# Altium schematic sheet Module_Esp32.SchDoc
size A4
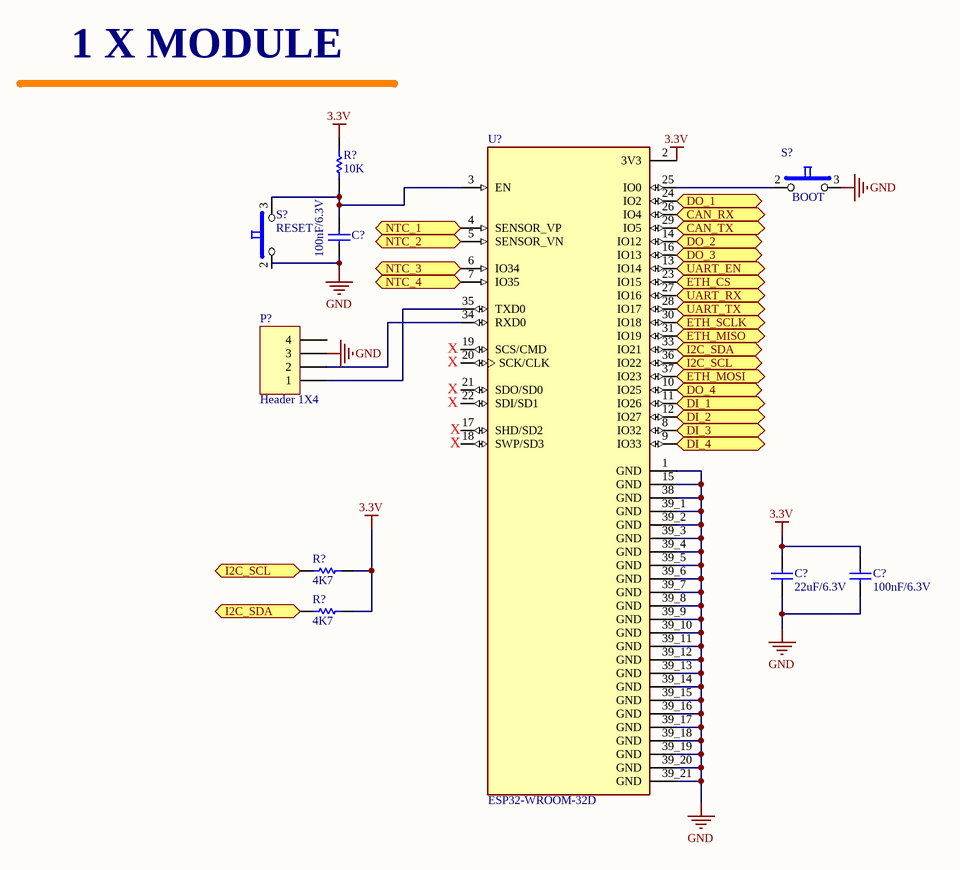
[diagram p0: Module_Esp32.SchDoc]

## Parts
(Parts that share a designator on the sheet are numbered #1, #2 ... from top to bottom, then left to right.)
C?#1  100nF/6.3V  [CAP0603W]
C?#2  22uF/6.3V  [CAP0603W]
C?#3  100nF/6.3V  [CAP0603W]
P?  Header 1X4  [HDR1X4]
R?#1  10K  [RES1608[0603]]
R?#2  4K7  [RES1608[0603]]
R?#3  4K7  [RES1608[0603]]
S?#1  BOOT  [BUTTON TACT 6.2x7. 3.85MM 100gf 90C]
S?#2  RESET  [BUTTON TACT 6.2x7. 3.85MM 100gf 90C]
U?  ESP32-WROOM-32D  [MODULE_ESP32-WROOM-32D]

## Ports
CAN_RX, CAN_TX, DI_1, DI_2, DI_3, DI_4, DO_1, DO_2, DO_3, DO_4, ETH_CS, ETH_MISO, ETH_MOSI, ETH_SCLK, I2C_SCL, I2C_SDA, NTC_1, NTC_2, NTC_3, NTC_4, UART_EN, UART_RX, UART_TX

## Nets
3.3V: C?#2.1 C?#3.1 R?#1.1 R?#2.1 R?#3.1 U?.2(3V3)
GND: C?#1.2 C?#2.2 C?#3.2 P?.3 S?#1.3 S?#2.2 U?.1(GND) U?.15(GND) U?.38(GND) U?.39_1(GND) U?.39_2(GND) U?.39_3(GND) U?.39_4(GND) U?.39_5(GND) U?.39_6(GND) U?.39_7(GND) U?.39_8(GND) U?.39_9(GND) U?.39_10(GND) U?.39_11(GND) U?.39_12(GND) U?.39_13(GND) U?.39_14(GND) U?.39_15(GND) U?.39_16(GND) U?.39_17(GND) U?.39_18(GND) U?.39_19(GND) U?.39_20(GND) U?.39_21(GND)
CAN_RX: U?.26(IO4) ; port CAN_RX
CAN_TX: U?.29(IO5) ; port CAN_TX
DI_1: U?.11(IO26) ; port DI_1
DI_2: U?.12(IO27) ; port DI_2
DI_3: U?.8(IO32) ; port DI_3
DI_4: U?.9(IO33) ; port DI_4
DO_1: U?.24(IO2) ; port DO_1
DO_2: U?.14(IO12) ; port DO_2
DO_3: U?.16(IO13) ; port DO_3
DO_4: U?.10(IO25) ; port DO_4
ETH_CS: U?.23(IO15) ; port ETH_CS
ETH_MISO: U?.31(IO19) ; port ETH_MISO
ETH_MOSI: U?.37(IO23) ; port ETH_MOSI
ETH_SCLK: U?.30(IO18) ; port ETH_SCLK
I2C_SCL: R?#2.2 U?.36(IO22) ; port I2C_SCL
I2C_SDA: R?#3.2 U?.33(IO21) ; port I2C_SDA
NTC_1: U?.4(SENSOR_VP) ; port NTC_1
NTC_2: U?.5(SENSOR_VN) ; port NTC_2
NTC_3: U?.6(IO34) ; port NTC_3
NTC_4: U?.7(IO35) ; port NTC_4
UART_EN: U?.13(IO14) ; port UART_EN
UART_RX: U?.27(IO16) ; port UART_RX
UART_TX: U?.28(IO17) ; port UART_TX
NetC?#1_1: C?#1.1 R?#1.2 S?#2.3 U?.3(EN)
NetP?_1: P?.1 U?.35(TXD0)
NetP?_2: P?.2 U?.34(RXD0)
NetS?#1_2: S?#1.2 U?.25(IO0)

Not connected (* = marked no-connect by the designer): P? 4; U? 17(SHD/SD2) 18(SWP/SD3) 19(SCS/CMD) 20(SCK/CLK) 21(SDO/SD0) 22(SDI/SD1)

## Notes on the sheet
- 1 X MODULE
- (near U?) X

## Library data of the parts
C?#1-C?#3 = CAP1: CAPACITOR Capacitor Semiconductor; Value: 100nF; Published: 8-Jun-2000; LatestRevisionDate: 17-Jul-2002; LatestRevisionNote: Re-released for DXP Platform.; PackageReference: C1206; Publisher: Altium Limited
P? = Header 1X4: Header, 4-Pin; LatestRevisionDate: 17-Jul-2002; LatestRevisionNote: Re-released for DXP Platform.; Publisher: Altium Limited
R?#1-R?#3 = RES: RESISTOR 0603 Case %1; Value: 430R; Published: 8-Jun-2000; LatestRevisionDate: 17-Jul-2002; LatestRevisionNote: Re-released for DXP Platform.; PackageReference: AXIAL-0.5; Publisher: Altium Limited
S?#1 S?#2 = BUTTON_DIP: SWITCH TACT 6.2x7. 3.85MM 100gf 90C
U? = ESP32-WROOM-32D: Bluetooth, WiFi 802.11b/g/n, Bluetooth v4.2 +EDR, Class 1, 2 and 3 Transceiver Module 2.4GHz ~ 2.5GHz Integrated; MF: Espressif Systems; Price: None; Availability: In Stock; Package: Module Espressif Systems; MP: ESP32-WROOM-32D; Value: *; SnapEDA_Link: https://www.snapeda.com/parts/ESP32-WROOM-32D/Espressif+Systems/view-part/?ref=snap; Purchase-URL: https://pricing.snapeda.com/search/part/ESP32-WROOM-32D/?ref=eda; Check_prices: https://www.snapeda.com/parts/ESP32-WROOM-32D/Espressif+Systems/view-part/?ref=eda